# Altium schematic sheet rtm-damp-dvb.SchDoc
size A4
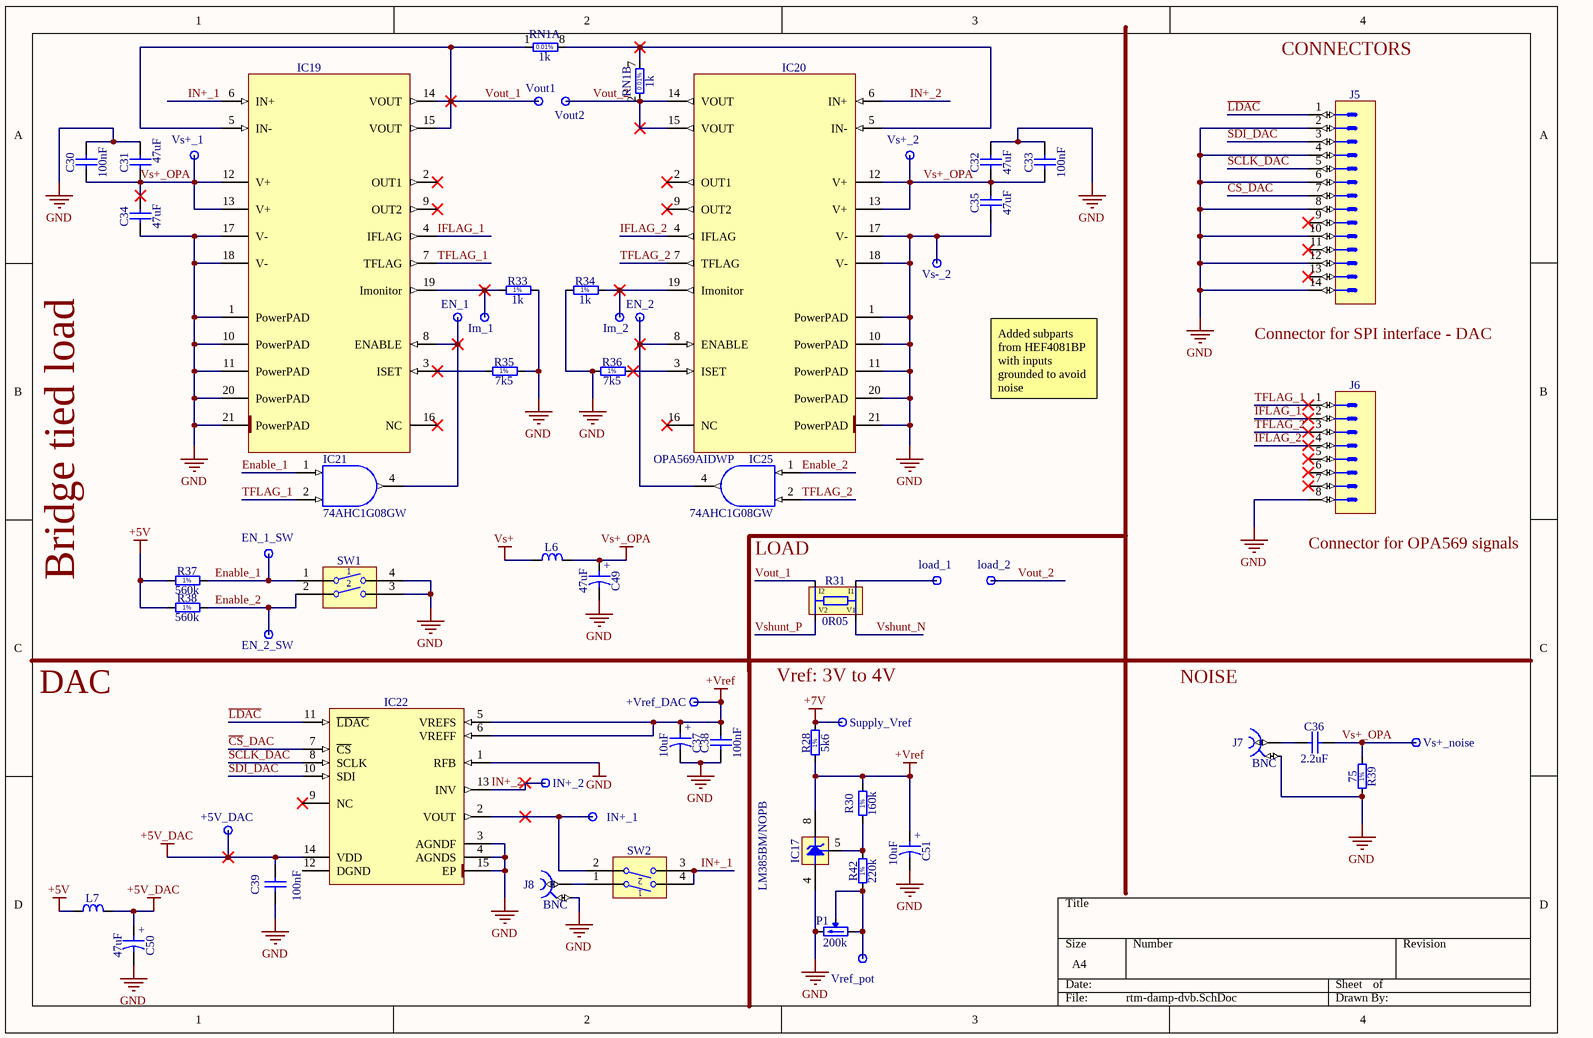
[diagram p0: rtm-damp-dvb.SchDoc]

## Parts
+5V_DAC  Test Point  [TPS127]  (value not drawn)
+Vref_DAC  Test Point  [TPS127]  (value not drawn)
C30  100nF  [CAPC2012X135N]
C31  47uF  [CAPC2012X140N]
C32  47uF  [CAPC2012X140N]
C33  100nF  [CAPC2012X135N]
C34  47uF  [CAPC2012X140N]
C35  47uF  [CAPC2012X140N]
C36  2.2uF  [CAPC2012X140N]
C37  10uF  [CAPAE530X540N]
C38  100nF  [CAPC2012X135N]
C39  100nF  [CAPC2012X135N]
C49  47uF  [CAPMP3528X210N]
C50  47uF  [CAPMP3528X210N]
C51  10uF  [CAPAE530X540N]
EN_1  Test Point  [TPS127]  (value not drawn)
EN_1_SW  Test Point  [TPS127]  (value not drawn)
EN_2  Test Point  [TPS127]  (value not drawn)
EN_2_SW  Test Point  [TPS127]  (value not drawn)
IC17  LM385BM/NOPB  [SOIC127P600X175-8N]
IC19  OPA569AIDWP  [SOIC127P1030X265-21N-R381X432]  (value not drawn)
IC20  OPA569AIDWP  [SOIC127P1030X265-21N-R381X432]
IC21  74AHC1G08GW  [SOT65P212X110-5N]
IC22  DAC8831ICRGYT  [TEXAS_RGY (S-PVQFN–N14)]  (value not drawn)
IC25  74AHC1G08GW  [SOT65P212X110-5N]
Im_1  Test Point  [TPS127]  (value not drawn)
Im_2  Test Point  [TPS127]  (value not drawn)
IN+_1  Test Point  [TPS127]  (value not drawn)
IN+_2  Test Point  [TPS127]  (value not drawn)
J5  Header 14  [SAMTEC_MTLW-107-07-L-D-250]  (value not drawn)
J6  Header 8  [SAMTEC_TSW-108-07-L-S-LL]  (value not drawn)
J7  BNC  [TYCO_1-1337542-0_a]
J8  BNC  [TYCO_1-1337542-0_a]
L6  600R@100MHz  [INDC1608X95N]  (value not drawn)
L7  1K@100MHz  [INDC1608X95N]  (value not drawn)
load_1  Banana  [SKS-HIRSCHMANN_930 176-100]  (value not drawn)
load_2  Banana  [SKS-HIRSCHMANN_930 176-100]  (value not drawn)
P1  200k  [TRIM_BOURNS_3224G]
R28  5k6  [RESC1608X55N]
R30  160k  [RESC1608X55N]
R31  0R05  [RES_VISHAY_WSK1206]
R33  1k  [RESC1608X55N]
R34  1k  [RESC1608X55N]
R35  7k5  [RESC1608X55N]
R36  7k5  [RESC1608X55N]
R37  560k  [RESC1608X55N]
R38  560k  [RESC1608X55N]
R39  75  [RESC2012X60N]
R42  220k  [RESC1608X55N]
RN1  1k  [SOIC127P600X175-8N]  (parts A,B of 4)
Supply_Vref  Test Point  [TPS127]  (value not drawn)
SW1  Switch  [SW_TYCO_1571983-1]  (value not drawn)
SW2  Switch  [SW_TYCO_1571983-1]  (value not drawn)
Vout1  Test Point  [TPS127]  (value not drawn)
Vout2  Test Point  [TPS127]  (value not drawn)
Vref_pot  Test Point  [TPS127]  (value not drawn)
Vs+_1  Test Point  [TPS127]  (value not drawn)
Vs+_2  Test Point  [TPS127]  (value not drawn)
Vs+_noise  Test Point  [TPS127]  (value not drawn)
Vs-_2  Test Point  [TPS127]  (value not drawn)

## Nets
+5V: IC21.5(VCC) IC25.5(VCC) L7.1 R37.1 R38.1
+5V_DAC: +5V_DAC.1 C39.2 C50.1 IC22.14(VDD) L7.2
+7V: R28.2 Supply_Vref.1
+Vref: +Vref_DAC.1 C37.1 C38.2 C51.1 IC17.8(C) IC22.5(VREFS) IC22.6(VREFF) R28.1 R30.2
GND: C30.2 C31.2 C32.2 C33.2 C34.1 C35.1 C37.2 C38.1 C39.1 C49.2 C50.2 C51.2 IC17.4(A) IC19.1(PowerPAD) IC19.10(PowerPAD) IC19.11(PowerPAD) IC19.17(V-) IC19.18(V-) IC19.20(PowerPAD) IC19.21(PowerPAD) IC20.1(PowerPAD) IC20.10(PowerPAD) IC20.11(PowerPAD) IC20.17(V-) IC20.18(V-) IC20.20(PowerPAD) IC20.21(PowerPAD) IC21.3(GND) IC22.1(RFB) IC22.3(AGNDF) IC22.4(AGNDS) IC22.15(EP) IC25.3(GND) J5.2 J5.4 J5.6 J5.8 J5.10 J5.12 J5.14 J6.8 J7.2 J8.2 P1.3(CW) R33.2 R34.1 R35.2 R36.1 R39.1 SW1.3 SW1.4 Vs-_2.1
Vs+: L6.1
Vs+_OPA: C30.1 C31.1 C32.1 C33.1 C34.2 C35.2 C36.1 C49.1 IC19.12(V+) IC19.13(V+) IC20.12(V+) IC20.13(V+) L6.2 R39.2 Vs+_1.1 Vs+_2.1 Vs+_noise.1
~{CS}_DAC: IC22.7(~{CS}) J5.7
Enable_1: EN_1_SW.1 IC21.1(B) R37.2 SW1.1
Enable_2: EN_2_SW.1 IC25.1(B) R38.2 SW1.2
IFLAG_1: IC19.4(IFLAG) J6.2
IFLAG_2: IC20.4(IFLAG) J6.4
IN+_1: IC19.6(IN+) SW2.3 SW2.4
IN+_2: IC20.6(IN+) IC22.13(INV) IN+_2.1
~{LDAC}: IC22.11(~{LDAC}) J5.1
SCLK_DAC: IC22.8(SCLK) J5.5
SDI_DAC: IC22.10(SDI) J5.3
TFLAG_1: IC19.7(TFLAG) IC21.2(A) J6.1
TFLAG_2: IC20.7(TFLAG) IC25.2(A) J6.3
Vout_1: IC19.5(IN-) IC19.14(VOUT) IC19.15(VOUT) R31.I2 RN1.1 Vout1.1
Vout_2: IC20.14(VOUT) IC20.15(VOUT) load_2.1 RN1.2 Vout2.1
Vshunt_N: R31.V1
Vshunt_P: R31.V2
NetC36_2: C36.2 J7.1
NetEN_1_1: EN_1.1 IC19.8(ENABLE) IC21.4(Y)
NetEN_2_1: EN_2.1 IC20.8(ENABLE) IC25.4(Y)
NetIC17_5: IC17.5(Adj) R30.1 R42.2
NetIC19_3: IC19.3(ISET) R35.1
NetIC19_19: IC19.19(Imonitor) Im_1.1 R33.1
NetIC20_3: IC20.3(ISET) R36.2
NetIC20_5: IC20.5(IN-) RN1.7 RN1.8
NetIC20_19: IC20.19(Imonitor) Im_2.1 R34.2
NetIC22_2: IC22.2(VOUT) IN+_1.1 SW2.2
NetJ8_1: J8.1 SW2.1
Netload_1_1: load_1.1 R31.I1
NetP1_1: P1.1(CCW) P1.2(W) R42.1 Vref_pot.1

Not connected (* = marked no-connect by the designer): IC19 2(OUT1)* 9(OUT2)* 16(NC)*; IC20 2(OUT1)* 9(OUT2)* 16(NC)*; IC22 9(NC)* 12(DGND); J5 9* 11* 13*; J6 5* 6* 7*

## Notes on the sheet
- CONNECTORS
- (near J5) Connector for SPI interface - DAC
- Added subparts from HEF4081BP with inputs grounded to avoid noise
- Bridge tied load
- LOAD
- (near J6) Connector for OPA569 signals
- DAC
- Vref: 3V to 4V
- NOISE
- (in symbol CAE530-540_10UF_35V_20%) +
- (in symbol CTE3528-21_47UF_6.3V_10%_LESR0250) +
- (in symbol R0603_1K_1%_0.1W_100PPM) 1%
- (in symbol R0603_5K6_1%_0.1W_100PPM) 1%
- (in symbol R0603_7K5_1%_0.1W_100PPM) 1%
- (in symbol R0603_160K_1%_0.1W_100PPM) 1%
- (in symbol R0603_220K_1%_0.1W_100PPM) 1%
- (in symbol R0603_560K_1%_0.1W_100PPM) 1%
- (in symbol R0805_75R_1%_0.125W_100PPM) 1%

## Library data of the parts
+5V_DAC +Vref_DAC EN_1 EN_1_SW EN_2 EN_2_SW Im_1 Im_2 IN+_1 IN+_2 Supply_Vref Vout1 Vout2 Vref_pot Vs+_1 Vs+_2 Vs+_noise Vs-_2 = SMD_PAD_1.27X1.27MM: Part Description: 1.27mm x 1.27mm PCB Copper Area (SMD Test Point); Mounted: No; Part Number: SMD_PAD_1.27X1.27MM; Component Kind: Standard (No BOM); Component Type: Standard (No BOM); Pin Count: 1; Family: Test Point; Socket: No; SMD: Yes; Sense: No; Status: None; ComponentHeight: 0mm; HelpURL: Undefined; Author: CERN DEM JLC; CreateDate: 12/01/2008; LatestRevisionDate: 12/01/2008; PackageDescription: 1.27mm x 1.27mm PCB Copper Area (SMD Test Point)
C30 C33 C38 C39 = CC0805_100NF_50V_10%_X7R: Non-polarised capacitor; Part Description: SMD Multilayer Chip Ceramic Capacitor; Manufacturer: GENERIC; Manufacturer1 Part Number: C2012X7R1H104K085AA; Voltage: 50V; TC: X7R; Tolerance: ±10%; Part Number: CC0805_100NF_50V_10%_X7R; Component Kind: Standard; Component Type: Standard; Pin Count: 2; Value: 100nF; Status: Preferred; Manufacturer Part Number: CC0805_100NF_50V_10%_X7R; Case: 0805; Mounted: Yes; Socket: No; SMD: Yes; Sense: No; Manufacturer1 Example: TDK; Manufacturer1 ComponentHeight: 1mm; HelpURL: \\cern.ch\dfs\Applications\Altium\Datasheets\CC0805_X7R_TDK_C.pdf; Author: CERN DEM JLC; CreateDate: 03/12/2007; LatestRevisionDate: 22/04/2015
C31 C32 C34 C35 = CC0805_47UF_6.3V_20%_X5R: Non-polarised capacitor; Part Description: SMD Multilayer Chip Ceramic Capacitor; Manufacturer: GENERIC; Manufacturer1 Part Number: C0805C476M9PACTU; Voltage: 6.3V; TC: X5R; Tolerance: ±20%; Part Number: CC0805_47UF_6.3V_20%_X5R; Component Kind: Standard; Component Type: Standard; Pin Count: 2; Value: 47uF; Status: Preferred; Manufacturer Part Number: CC0805_47UF_6.3V_20%_X5R; Case: 0805; Mounted: Yes; Socket: No; SMD: Yes; Sense: No; Manufacturer1 Example: KEMET; Manufacturer1 ComponentHeight: 1.4mm; HelpURL: \\cern.ch\dfs\Applications\Altium\Datasheets\CC0805_X5R_KEMET.pdf; Author: CERN DEM JLC; CreateDate: 16/10/2012; LatestRevisionDate: 16/10/2012
C36 = CC0805_2.2UF_50V_10%_X7R: Non-polarised capacitor; Part Description: SMD Multilayer Chip Ceramic Capacitor; Manufacturer: GENERIC; Manufacturer1 Part Number: GRM21BR61H225KA73L; Voltage: 50V; TC: X7R; Tolerance: ±10%; Part Number: CC0805_2.2UF_50V_10%_X7R; Component Kind: Standard; Component Type: Standard; Pin Count: 2; Value: 2.2uF; Status: Preferred; Manufacturer Part Number: CC0805_2.2UF_50V_10%_X7R; Case: 0805; Mounted: Yes; Socket: No; SMD: Yes; Sense: No; Manufacturer1 Example: MURATA; Manufacturer1 ComponentHeight: 1.40mm; HelpURL: \\cern.ch\dfs\Applications\Altium\Datasheets\CC0805_X7R_MURATA_GRM.pdf; Author: CERN DEM JLC; CreateDate: 18/08/2014; LatestRevisionDate: 18/08/2014
C37 C51 = CAE530-540_10UF_35V_20%: Polarised capacitor; Part Description: Aluminum Electrolytic SMT Capacitor; Manufacturer: PANASONIC; Manufacturer Part Number: EEEFK1V100AR; Voltage: 35V; Tolerance: ±20%; Part Number: CAE530-540_10UF_35V_20%; Component Kind: Standard; Component Type: Standard; Pin Count: 2; Value: 10uF; Status: Not Recommended; Case: C; Mounted: Yes; Socket: No; SMD: Yes; Sense: No; ComponentHeight: 5.8mm; HelpURL: \\cern.ch\dfs\Applications\Altium\Datasheets\CAE_PANASONIC_FK.pdf; Author: CERN DEM JLC; CreateDate: 03/12/2007; LatestRevisionDate: 05/11/2014
C49 C50 = CTE3528-21_47UF_6.3V_10%_LESR0250: Polarised capacitor; Part Description: Low ESR 0R25 Solid Tantalum Chip Capacitor; Manufacturer: GENERIC; Manufacturer1 Part Number: TPSB476K006R0250; Voltage: 6.3V; Tolerance: ±10%; Part Number: CTE3528-21_47UF_6.3V_10%_LESR0250; Component Kind: Standard; Component Type: Standard; Pin Count: 2; Value: 47uF; Status: Preferred; Manufacturer Part Number: CTE3528-21_47UF_6.3V_10%_LESR0250; Case: B; Mounted: Yes; Socket: No; SMD: Yes; Sense: No; Manufacturer1 Example: AVX; Manufacturer1 ComponentHeight: 2.1mm; HelpURL: \\cern.ch\dfs\Applications\Altium\Datasheets\CTE-LESR_AVX_TPS.pdf; Author: CERN DEM JLC; CreateDate: 05/05/2008; LatestRevisionDate: 20/01/2009
IC17 = LM385BM/NOPB: 1.24V to 5.30V Adjustable Micropower Voltage Reference; Manufacturer: TEXAS INSTRUMENTS; PressFit: No; Bonding: No; Part Number: LM385BM/NOPB; Component Kind: Standard; Component Type: Standard; Device: LM385BM/NOPB; PackageDescription: SOIC 8, Pitch 1.27mm, Body 4x5mm, IPC Medium Density; Part Description: 1.24V to 5.30V Adjustable Micropower Voltage Reference; Manufacturer Part Number: LM385BM/NOPB; Pin Count: 8; Case: SOIC8; Mounted: Yes; Socket: No; SMD: Yes; Sense: No; ComponentHeight: 1.75mm; HelpURL: \\cern.ch\dfs\Applications\Altium\Datasheets\LM385BM-NOPB.pdf; Author: CERN DEM JLC; CreateDate: 24/03/2015; LatestRevisionDate: 24/03/2015
IC19 IC20 = OPA569AIDWP: Rail-to-Rail I/O, 2A, Power amplifier; Manufacturer: TEXAS INSTRUMENTS; PressFit: No; Bonding: No; Part Number: OPA569AIDWP; Component Kind: Standard; Component Type: Standard; Device: OPA569AIDWP; PackageDescription: SOIC 20, Pitch 1.27mm - Body 7.5x12.9mm, (w/thermal tab 3.81mm X 4.32mm), IPC Medium Density; Part Description: Rail-to-Rail I/O, 2A, Power amplifier; Manufacturer Part Number: OPA569AIDWP; Pin Count: 21; Case: SOIC20; Mounted: Yes; Socket: No; SMD: Yes; Sense: No; ComponentHeight: 2.65mm; Author: LNLS DIG LOS; CreateDate: 19/02/2018; LatestRevisionDate: 08/03/2018
IC21 IC25 = 74AHC1G08GW: Single 2-Input AND Gate; Manufacturer: NXP SEMICONDUCTORS; PressFit: No; Bonding: No; Part Number: 74AHC1G08GW; Component Kind: Standard; Component Type: Standard; Device: 74AHC1G08GW; PackageDescription: SOT353, SOT, 0.65mm Pitch, 5 pin, 1.25mm W X 2.05mm L X 1.10mm H, IPC Medium Density; Part Description: Single 2-Input AND Gate; Manufacturer Part Number: 74AHC1G08GW; Pin Count: 5; Case: SOT353; Mounted: Yes; Socket: No; SMD: Yes; Sense: No; ComponentHeight: 1.1mm; Author: CERN DEM JLC; HelpURL: \\cern.ch\dfs\Applications\Altium\Datasheets\74AHC1G08GW.pdf; CreateDate: 31/08/2010; LatestRevisionDate: 31/08/2010
IC22 = DAC8831ICRGYT: 16-Bit, Ultra-Low Power, Voltage-Output Digital-to-Analog Converter; Manufacturer: TEXAS INSTRUMENTS; PressFit: No; Bonding: No; Part Number: DAC8831ICRGYT; Component Kind: Standard; Component Type: Standard; Device: DAC8831ICRGYT; PackageDescription: TEXAS Case Style RGY (S-PVQFN-N14), QFN, 0.50mm Pitch, Square; 14 Pin, 3.5mm L X 3.5mm W X 1.00mm H body (w/thermal tab 2.15 X 2.15mm); Part Description: 16-Bit, Ultra-Low Power, Voltage-Output Digital-to-Analog Converter; Manufacturer Part Number: DAC8831ICRGYT; Pin Count: 15; Case: QFN14; Mounted: Yes; Socket: No; SMD: Yes; Sense: No; ComponentHeight: 1mm; Author: LNLS DIG LOS; CreateDate: 13/06/2018; LatestRevisionDate: 13/06/2018
J5 = SAMTEC_MTLW-107-07-L-D-250: Connector 14 Male; Part Description: 14 Contacts - Pitch 2.54mm - Dual Row Through Mount Straight Header (Post Lead = 6.35mm, Tail Lead 3.05mm, Insulator 1.52mm); Manufacturer: SAMTEC; PressFit: No; Part Number: SAMTEC_MTLW-107-07-L-D-250; Component Kind: Standard; Component Type: Standard; Pin Count: 14; Family: Header 14; Mounted: Yes; Socket: No; Sense: No; SMD: No; Status: None; Manufacturer Part Number: MTLW-107-07-L-D-250; ComponentHeight: 7.87mm; HelpURL: \\cern.ch\dfs\Applications\Altium\Datasheets\SAMTEC_MTLW-107-07-L-D-250.pdf; Author: CERN DEM JLC; CreateDate: 27/08/2013; LatestRevisionDate: 27/08/2013
J6 = SAMTEC_TSW-108-07-L-S-LL: Connector 8 Male; Part Description: 8 Contacts - Pitch 2.54mm - Single Row  Through Mount Straigh Header (Post Lead 5.84mm, Tail Lead 2.54mm, Insulator 2.54mm); Manufacturer: SAMTEC; PressFit: No; Part Number: SAMTEC_TSW-108-07-L-S-LL; Component Kind: Standard; Component Type: Standard; Pin Count: 8; Family: Header 8; Mounted: Yes; Socket: No; Sense: No; SMD: No; Status: None; Manufacturer Part Number: TSW-108-07-L-S-LL; ComponentHeight: 8.38mm; HelpURL: \\cern.ch\dfs\Applications\Altium\Datasheets\SAMTEC_TSW-108-07-L-S-LL.pdf; Author: CERN DEM MR; CreateDate: 15/07/2016; LatestRevisionDate: 15/07/2016
J7 J8 = TYCO_1-1337542-0_a: Part Description: 50 Ohms  BNC Elbow PCB Socket With Mounting Posts + Mount Nut + Lockwasher; Manufacturer: TYCO ELECTRONICS; Manufacturer Part Number: 1-1337542-0 + 1-1634816-0 + 1-1634817-0; PressFit: No; Part Number: TYCO_1-1337542-0_a; Component Kind: Standard; Component Type: Standard; Pin Count: 2; Family: BNC; Mounted: Yes; Socket: No; SMD: No; Sense: No; Status: None; ComponentHeight: 14.93mm; HelpURL: \\cern.ch\dfs\Applications\Altium\Datasheets\TYCO_1-1337542-0.pdf; Author: CERN DEM JLC; CreateDate: 02/02/2012; LatestRevisionDate: 02/02/2012
L6 = IND0603_MURATA_BLM18KG601SN1: Inductor; Part Description: SMD EMIFIL Suppression Chip Ferrite Bead for  GHz Noise; Manufacturer: MURATA; Power: 1.3A; Resistance: 0.15R; Tolerance: ±25%; Part Number: IND0603_MURATA_BLM18KG601SN1; Component Kind: Standard; Component Type: Standard; Pin Count: 2; Value: 600R@100MHz; Status: None; Manufacturer Part Number: BLM18KG601SN1; Case: 0603; Mounted: Yes; Socket: No; SMD: Yes; Sense: No; ComponentHeight: 0.95mm; Author: LNLS DIG LOS; CreateDate: 21/06/2018; LatestRevisionDate: 21/06/2018
L7 = IND0603_MURATA_BLM18AG102SN1D: Inductor; Part Description: SMD EMIFIL Suppression Chip Ferrite Bead; Manufacturer: MURATA; Power: 400mA; Resistance: 0.50R; Tolerance: ±25%; Part Number: IND0603_MURATA_BLM18AG102SN1D; Component Kind: Standard; Component Type: Standard; Pin Count: 2; Value: 1K@100MHz; Status: None; Manufacturer Part Number: BLM18AG102SN1D; Case: 0603; Mounted: Yes; Socket: No; SMD: Yes; Sense: No; ComponentHeight: 0.95mm; Author: LNLS DIG GBMB; CreateDate: 03/11/2017; LatestRevisionDate: 03/11/2017
load_1 load_2 = SKS-HIRSCHMANN_930 176-100: Single Terminal Socket; Part Description: BIL 20 Black Socket For Banana 4mm; Manufacturer: SKS KONTATTECHNIK - HIRSCHMANN; PressFit: No; Part Number: SKS-HIRSCHMANN_930 176-100; Component Kind: Standard; Component Type: Standard; Pin Count: 1; Family: Banana; Mounted: Yes; Socket: No; SMD: No; Sense: No; Status: None; Manufacturer Part Number: 930 176-100; ComponentHeight: 5mm; HelpURL: \\cern.ch\dfs\Applications\Altium\Datasheets\SKS-HIRSCHMANN_930 176-100.pdf; Author: CERN DEM JLC; CreateDate: 12/06/2008; LatestRevisionDate: 12/06/2008
P1 = TRIM_12T_200K_BOURNS_3224G-1-204E: Trimming Potentiometer; Part Description: 12 Turns SMD Trimpot® Trimming Potentiometer (Side Adjust); Manufacturer: BOURNS; Power: 0.25W; TC: ±100ppm/°C; Tolerance: ±10%; Part Number: TRIM_12T_200K_BOURNS_3224G-1-204E; Component Kind: Standard; Component Type: Standard; Pin Count: 3; Value: 200k; Manufacturer Part Number: 3224G-1-204E; Case: 3224G; Mounted: Yes; Socket: No; SMD: Yes; Sense: No; ComponentHeight: 3.9mm; HelpURL: \\cern.ch\dfs\Applications\Altium\Datasheets\TRIM_BOURNS_3224G.pdf; Author: CERN DEM JLC; CreateDate: 14/04/2014; LatestRevisionDate: 14/04/2014
R28 = R0603_5K6_1%_0.1W_100PPM: Resistor - 1%; Part Description: General Purpose Thick Film Chip Resistor; Manufacturer: GENERIC; Manufacturer1 Part Number: NRC06F5601TRF; Power: 0.1W; TC: ±100ppm/°C; Part Number: R0603_5K6_1%_0.1W_100PPM; Component Kind: Standard; Component Type: Standard; Pin Count: 2; Value: 5k6; Status: Preferred; Tolerance: ±1%; Manufacturer Part Number: R0603_5K6_1%_0.1W_100PPM; Case: 0603; Mounted: Yes; Sense: No; Socket: No; SMD: Yes; Manufacturer1 Example: NIC COMPONENT; Manufacturer1 ComponentHeight: 0.55mm; HelpURL: \\cern.ch\dfs\Applications\Altium\Datasheets\R0603_NIC_NRC.pdf; Author: CERN DEM JLC; CreateDate: 03/12/2007; LatestRevisionDate: 13/03/2008
R30 = R0603_160K_1%_0.1W_100PPM: Resistor - 1%; Part Description: General Purpose Thick Film Chip Resistor; Manufacturer: GENERIC; Manufacturer1 Part Number: NRC06F1603TRF; Power: 0.1W; TC: ±100ppm/°C; Part Number: R0603_160K_1%_0.1W_100PPM; Component Kind: Standard; Component Type: Standard; Pin Count: 2; Value: 160k; Status: Preferred; Tolerance: ±1%; Manufacturer Part Number: R0603_160K_1%_0.1W_100PPM; Case: 0603; Mounted: Yes; Sense: No; Socket: No; SMD: Yes; Manufacturer1 Example: NIC COMPONENT; Manufacturer1 ComponentHeight: 0.55mm; HelpURL: \\cern.ch\dfs\Applications\Altium\Datasheets\R0603_NIC_NRC.pdf; Author: CERN DEM JLC; CreateDate: 03/12/2007; LatestRevisionDate: 13/03/2008
R31 = R1206_0R05_1%_0.5W_35PPM_VISHAY: Power and Current Sensing Resistor; Part Description: Four Terminal Current Sense; Manufacturer: Vishay; Manufacturer Part Number: WSK1206R0500FEA18; Power: 0.5W; TC: ±35ppm/°C; Tolerance: ±1%; Part Number: R1206_0R05_1%_0.5W_35PPM_VISHAY; Component Kind: Standard; Component Type: Standard; Pin Count: 4; Value: 0R05; Status: None; Case: WSK1206; Mounted: Yes; Sense: No; Socket: No; SMD: Yes; ComponentHeight: 0.7mm; Author: LNLS DIG GBMB; CreateDate: 05/11/2018; LatestRevisionDate: 05/11/2018
R33 R34 = R0603_1K_1%_0.1W_100PPM: Resistor - 1%; Part Description: General Purpose Thick Film Chip Resistor; Manufacturer: GENERIC; Manufacturer1 Part Number: NRC06F1001TRF; Power: 0.1W; TC: ±100ppm/°C; Part Number: R0603_1K_1%_0.1W_100PPM; Component Kind: Standard; Component Type: Standard; Pin Count: 2; Value: 1k; Status: Preferred; Tolerance: ±1%; Manufacturer Part Number: R0603_1K_1%_0.1W_100PPM; Case: 0603; Mounted: Yes; Sense: No; Socket: No; SMD: Yes; Manufacturer1 Example: NIC COMPONENT; Manufacturer1 ComponentHeight: 0.55mm; HelpURL: \\cern.ch\dfs\Applications\Altium\Datasheets\R0603_NIC_NRC.pdf; Author: CERN DEM JLC; CreateDate: 03/12/2007; LatestRevisionDate: 13/03/2008
R35 R36 = R0603_7K5_1%_0.1W_100PPM: Resistor - 1%; Part Description: General Purpose Thick Film Chip Resistor; Manufacturer: GENERIC; Manufacturer1 Part Number: NRC06F7501TRF; Power: 0.1W; TC: ±100ppm/°C; Part Number: R0603_7K5_1%_0.1W_100PPM; Component Kind: Standard; Component Type: Standard; Pin Count: 2; Value: 7k5; Status: Preferred; Tolerance: ±1%; Manufacturer Part Number: R0603_7K5_1%_0.1W_100PPM; Case: 0603; Mounted: Yes; Sense: No; Socket: No; SMD: Yes; Manufacturer1 Example: NIC COMPONENT; Manufacturer1 ComponentHeight: 0.55mm; HelpURL: \\cern.ch\dfs\Applications\Altium\Datasheets\R0603_NIC_NRC.pdf; Author: CERN DEM JLC; CreateDate: 03/12/2007; LatestRevisionDate: 13/03/2008
R37 R38 = R0603_560K_1%_0.1W_100PPM: Resistor - 1%; Part Description: General Purpose Thick Film Chip Resistor; Manufacturer: GENERIC; Manufacturer1 Part Number: NRC06F5603TRF; Power: 0.1W; TC: ±100ppm/°C; Part Number: R0603_560K_1%_0.1W_100PPM; Component Kind: Standard; Component Type: Standard; Pin Count: 2; Value: 560k; Status: Preferred; Tolerance: ±1%; Manufacturer Part Number: R0603_560K_1%_0.1W_100PPM; Case: 0603; Mounted: Yes; Sense: No; Socket: No; SMD: Yes; Manufacturer1 Example: NIC COMPONENT; Manufacturer1 ComponentHeight: 0.55mm; HelpURL: \\cern.ch\dfs\Applications\Altium\Datasheets\R0603_NIC_NRC.pdf; Author: CERN DEM JLC; CreateDate: 03/12/2007; LatestRevisionDate: 13/03/2008
R39 = R0805_75R_1%_0.125W_100PPM: Resistor - 1%; Part Description: General Purpose Thick Film Chip Resistor; Manufacturer: GENERIC; Manufacturer1 Part Number: NRC10F75R0TRF; Power: 0.125W; TC: ±100ppm/°C; Part Number: R0805_75R_1%_0.125W_100PPM; Component Kind: Standard; Component Type: Standard; Pin Count: 2; Value: 75; Status: Preferred; Tolerance: ±1%; Manufacturer Part Number: R0805_75R_1%_0.125W_100PPM; Case: 0805; Mounted: Yes; Sense: No; Socket: No; SMD: Yes; Manufacturer1 Example: NIC COMPONENT; Manufacturer1 ComponentHeight: 0.6mm; HelpURL: \\cern.ch\dfs\Applications\Altium\Datasheets\R0805_NIC_NRC.pdf; Author: CERN DEM JLC; CreateDate: 03/12/2007; LatestRevisionDate: 13/03/2008
R42 = R0603_220K_1%_0.1W_100PPM: Resistor - 1%; Part Description: General Purpose Thick Film Chip Resistor; Manufacturer: GENERIC; Manufacturer1 Part Number: NRC06F2203TRF; Power: 0.1W; TC: ±100ppm/°C; Part Number: R0603_220K_1%_0.1W_100PPM; Component Kind: Standard; Component Type: Standard; Pin Count: 2; Value: 220k; Status: Preferred; Tolerance: ±1%; Manufacturer Part Number: R0603_220K_1%_0.1W_100PPM; Case: 0603; Mounted: Yes; Sense: No; Socket: No; SMD: Yes; Manufacturer1 Example: NIC COMPONENT; Manufacturer1 ComponentHeight: 0.55mm; HelpURL: \\cern.ch\dfs\Applications\Altium\Datasheets\R0603_NIC_NRC.pdf; Author: CERN DEM JLC; CreateDate: 03/12/2007; LatestRevisionDate: 13/03/2008
RN1 = RN_1K_1K_VISHAY_Y1365V0191QT9R: DIL8 Resistor Network 4 Isolated Resistor 0.01%; Part Description: Bulk Metal® Foil Thecnology High Precision 4 Resistors Network - SMN Series; Manufacturer: VISHAY FOIL RESISTOR; Power: 4x0.1W; TC: ±2ppm/°C; Part Number: RN_1K_1K_VISHAY_Y1365V0191QT9R; Component Kind: Standard; Component Type: Standard; Pin Count: 8; Value: 1k; Sense: No; Tolerance: 0.01%; Manufacturer Part Number: Y1365V0191QT9R; Case: SOIC8; Mounted: Yes; Socket: No; SMD: Yes; ComponentHeight: 1.73mm; HelpURL: \\cern.ch\dfs\Applications\Altium\Datasheets\RN_VISHAY_SMN.pdf; Author: CERN DEM JLC; CreateDate: 19/05/2014; LatestRevisionDate: 19/05/2014
SW1 SW2 = SW_TYCO_1571983-1: 2 Ways SPST DIP Switch; Part Description: 2 Way SPST SMD DIP Switch, Latched, Contact Rating 0.025A 24VDC; Manufacturer: TYCO; Manufacturer Part Number: 1571983-1 or GDH02S04; PressFit: No; Part Number: SW_TYCO_1571983-1; Component Kind: Standard; Component Type: Standard; Pin Count: 4; PackageDescription: Pitch 1.27mm,  Body3.66x6.2mm, 2 Ways SPST Surface-Mount DIP Switch, TYCO GDH Serie; Family: Switch; Mounted: Yes; Socket: No; SMD: Yes; Sense: No; Status: None; ComponentHeight: 2.31mm; HelpURL: \\cern.ch\dfs\Applications\Altium\Datasheets\SW_TYCO_1571983-1.pdf; Author: CERN DEM JLC; CreateDate: 08/01/2009; LatestRevisionDate: 08/01/2009